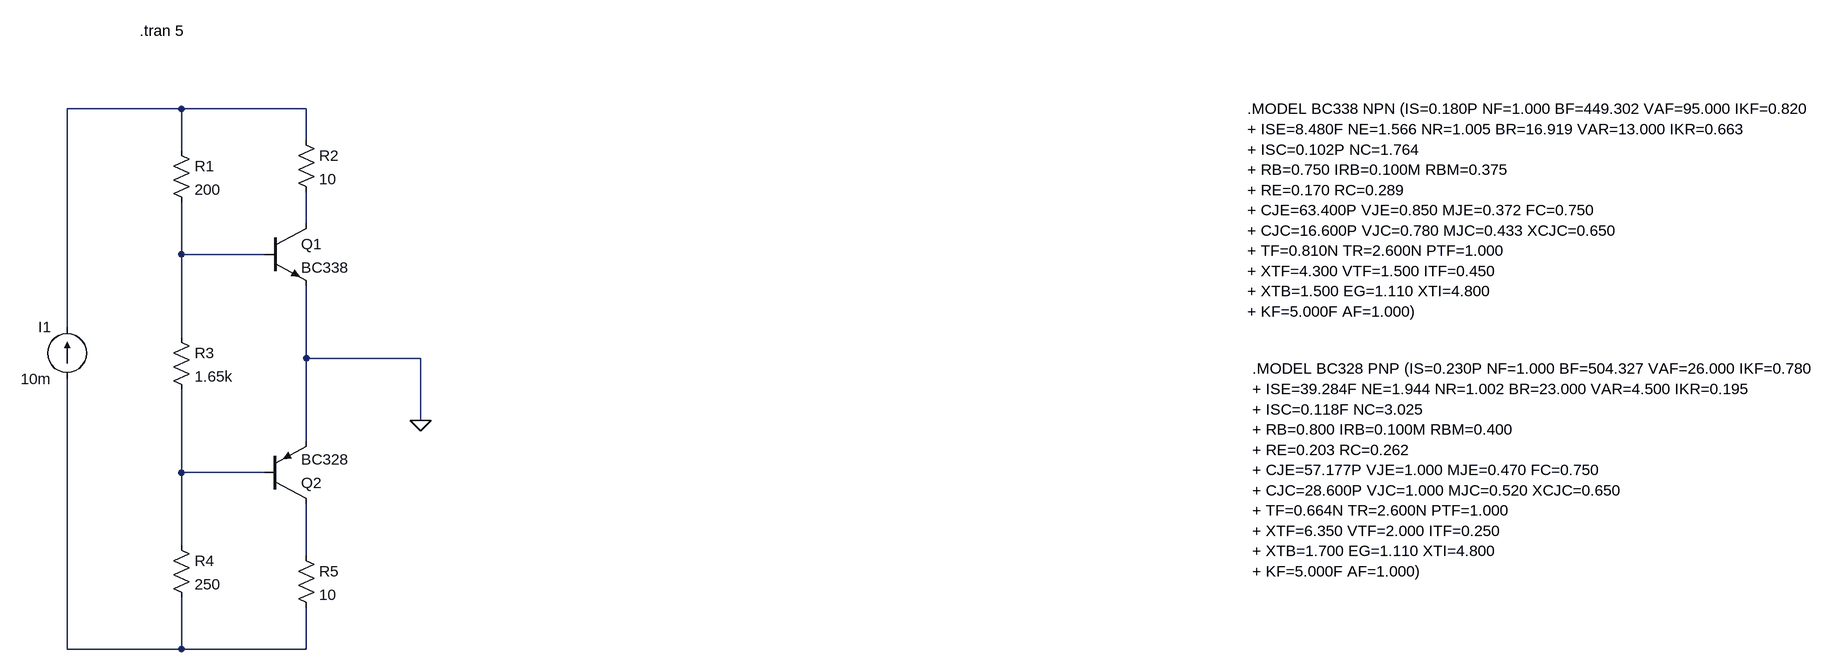
[diagram p0: schematic PrimeraEtapa.asc]
PrimeraEtapa.asc, the LTspice schematic file:
Version 4
SHEET 1 2500 728
WIRE -80 -112 -256 -112
WIRE 112 -112 -80 -112
WIRE 112 -64 112 -112
WIRE -80 -48 -80 -112
WIRE 112 64 112 16
WIRE -80 112 -80 32
WIRE 48 112 -80 112
WIRE -256 224 -256 -112
WIRE -80 240 -80 112
WIRE 112 272 112 160
WIRE 288 272 112 272
WIRE 288 368 288 272
WIRE 112 400 112 272
WIRE -80 448 -80 320
WIRE 48 448 -80 448
WIRE -80 560 -80 448
WIRE 112 576 112 496
WIRE -256 720 -256 304
WIRE -80 720 -80 640
WIRE -80 720 -256 720
WIRE 112 720 112 656
WIRE 112 720 -80 720
FLAG 288 368 0
SYMBOL npn 48 64 R0
SYMATTR InstName Q1
SYMATTR Value BC338
SYMBOL pnp 48 496 M180
SYMATTR InstName Q2
SYMATTR Value BC328
SYMBOL res -96 -64 R0
SYMATTR InstName R1
SYMATTR Value 200
SYMBOL res 96 -80 R0
SYMATTR InstName R2
SYMATTR Value 10
SYMBOL res -96 224 R0
SYMATTR InstName R3
SYMATTR Value 1.65k
SYMBOL res -96 544 R0
SYMATTR InstName R4
SYMATTR Value 250
SYMBOL res 96 560 R0
SYMATTR InstName R5
SYMATTR Value 10
SYMBOL current -256 304 R180
WINDOW 0 24 80 Left 2
WINDOW 3 24 0 Left 2
SYMATTR InstName I1
SYMATTR Value 10m
TEXT -144 -232 Left 2 !.tran 5
TEXT 1560 -112 Left 2 !.MODEL BC338 NPN (IS=0.180P NF=1.000 BF=449.302 VAF=95.000 IKF=0.820 \n+ ISE=8.480F NE=1.566 NR=1.005 BR=16.919 VAR=13.000 IKR=0.663 \n+ ISC=0.102P NC=1.764 \n+ RB=0.750 IRB=0.100M RBM=0.375 \n+ RE=0.170 RC=0.289 \n+ CJE=63.400P VJE=0.850 MJE=0.372 FC=0.750 \n+ CJC=16.600P VJC=0.780 MJC=0.433 XCJC=0.650 \n+ TF=0.810N TR=2.600N PTF=1.000 \n+ XTF=4.300 VTF=1.500 ITF=0.450 \n+ XTB=1.500 EG=1.110 XTI=4.800 \n+ KF=5.000F AF=1.000)
TEXT 1568 288 Left 2 !.MODEL BC328 PNP (IS=0.230P NF=1.000 BF=504.327 VAF=26.000 IKF=0.780 \n+ ISE=39.284F NE=1.944 NR=1.002 BR=23.000 VAR=4.500 IKR=0.195 \n+ ISC=0.118F NC=3.025 \n+ RB=0.800 IRB=0.100M RBM=0.400 \n+ RE=0.203 RC=0.262 \n+ CJE=57.177P VJE=1.000 MJE=0.470 FC=0.750 \n+ CJC=28.600P VJC=1.000 MJC=0.520 XCJC=0.650 \n+ TF=0.664N TR=2.600N PTF=1.000 \n+ XTF=6.350 VTF=2.000 ITF=0.250 \n+ XTB=1.700 EG=1.110 XTI=4.800 \n+ KF=5.000F AF=1.000)

The netlist it stands for:
* PrimeraEtapa.asc
Q1 N002 N003 0 0 BC338
Q2 N005 N004 0 0 BC328
R1 N001 N003 200
R2 N001 N002 10
R3 N003 N004 1.65k
R4 N004 N006 250
R5 N005 N006 10
I1 N006 N001 10m
.model NPN NPN
.model PNP PNP
.lib standard.bjt
.tran 5
.MODEL BC338 NPN (IS=0.180P NF=1.000 BF=449.302 VAF=95.000 IKF=0.820
+ ISE=8.480F NE=1.566 NR=1.005 BR=16.919 VAR=13.000 IKR=0.663
+ ISC=0.102P NC=1.764
+ RB=0.750 IRB=0.100M RBM=0.375
+ RE=0.170 RC=0.289
+ CJE=63.400P VJE=0.850 MJE=0.372 FC=0.750
+ CJC=16.600P VJC=0.780 MJC=0.433 XCJC=0.650
+ TF=0.810N TR=2.600N PTF=1.000
+ XTF=4.300 VTF=1.500 ITF=0.450
+ XTB=1.500 EG=1.110 XTI=4.800
+ KF=5.000F AF=1.000)
.MODEL BC328 PNP (IS=0.230P NF=1.000 BF=504.327 VAF=26.000 IKF=0.780
+ ISE=39.284F NE=1.944 NR=1.002 BR=23.000 VAR=4.500 IKR=0.195
+ ISC=0.118F NC=3.025
+ RB=0.800 IRB=0.100M RBM=0.400
+ RE=0.203 RC=0.262
+ CJE=57.177P VJE=1.000 MJE=0.470 FC=0.750
+ CJC=28.600P VJC=1.000 MJC=0.520 XCJC=0.650
+ TF=0.664N TR=2.600N PTF=1.000
+ XTF=6.350 VTF=2.000 ITF=0.250
+ XTB=1.700 EG=1.110 XTI=4.800
+ KF=5.000F AF=1.000)
.backanno
.end